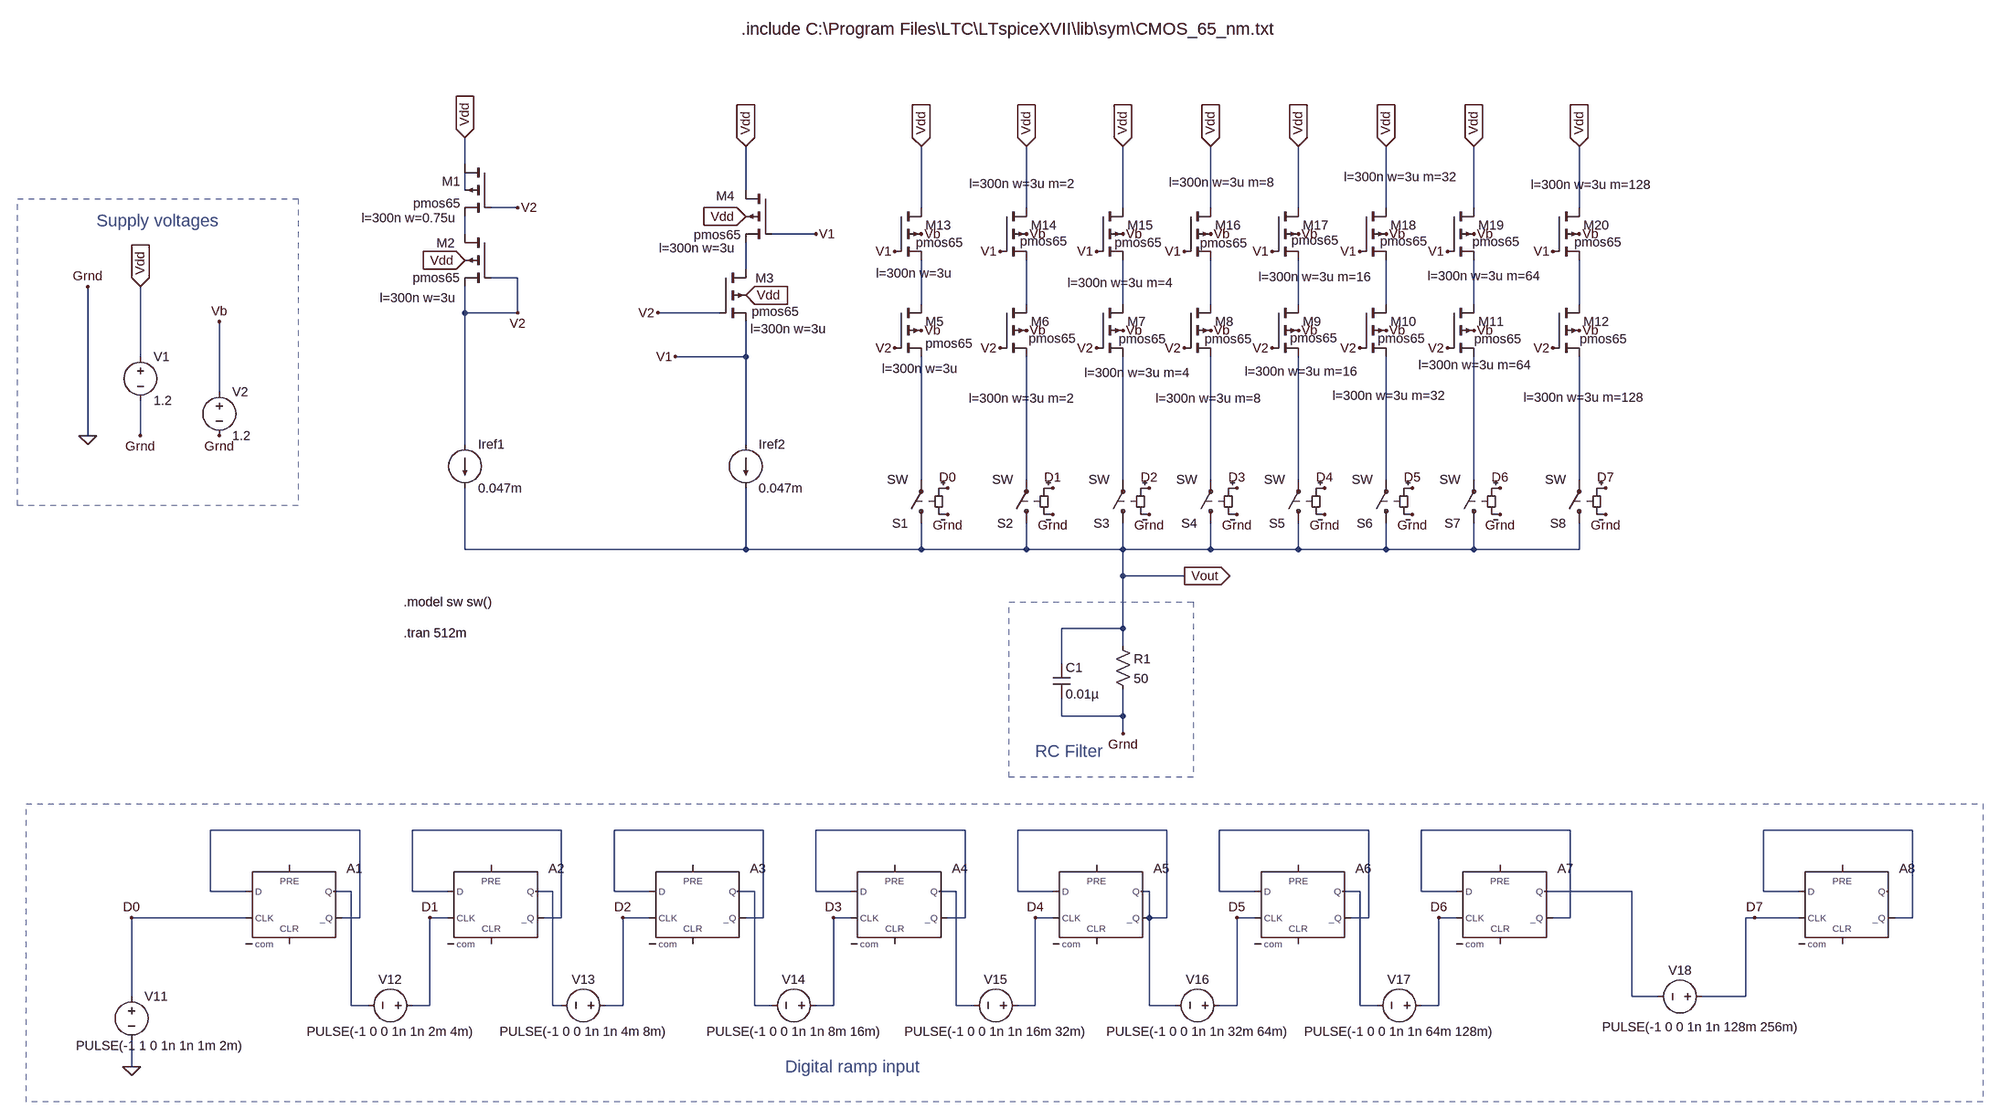
[diagram p0: schematic DAC_SOOCH_cm_capacitor_final.asc]
DAC_SOOCH_cm_capacitor_final.asc, the LTspice schematic file:
Version 4
SHEET 1 1972 2708
WIRE -800 -224 -800 -272
WIRE -800 -176 -800 -208
WIRE -288 -176 -288 -256
WIRE -704 -144 -752 -144
WIRE 32 -144 32 -256
WIRE 224 -144 224 -256
WIRE 400 -144 400 -256
WIRE 560 -144 560 -256
WIRE 720 -144 720 -256
WIRE 880 -144 880 -256
WIRE 1040 -144 1040 -256
WIRE 1232 -144 1232 -256
WIRE -800 -96 -800 -128
WIRE -160 -96 -240 -96
WIRE -288 -32 -288 -80
WIRE -704 -16 -752 -16
WIRE 32 32 32 -48
WIRE 224 32 224 -48
WIRE 400 32 400 -48
WIRE 560 32 560 -48
WIRE 720 32 720 -48
WIRE 880 32 880 -48
WIRE 1040 32 1040 -48
WIRE 1232 32 1232 -48
WIRE -800 48 -800 0
WIRE -704 48 -704 -16
WIRE -704 48 -800 48
WIRE -336 48 -448 48
WIRE -1392 128 -1392 0
WIRE -288 128 -288 64
WIRE -288 128 -416 128
WIRE -1248 192 -1248 64
WIRE -1488 272 -1488 0
WIRE -1392 272 -1392 208
WIRE -800 288 -800 48
WIRE -288 288 -288 128
WIRE 32 352 32 128
WIRE 224 352 224 128
WIRE 400 352 400 128
WIRE 560 352 560 128
WIRE 720 352 720 128
WIRE 880 352 880 128
WIRE 1040 352 1040 128
WIRE 1232 352 1232 128
WIRE -800 480 -800 368
WIRE -288 480 -288 368
WIRE -288 480 -800 480
WIRE 32 480 32 432
WIRE 32 480 -288 480
WIRE 224 480 224 432
WIRE 224 480 32 480
WIRE 400 480 400 432
WIRE 400 480 224 480
WIRE 560 480 560 432
WIRE 560 480 400 480
WIRE 720 480 720 432
WIRE 720 480 560 480
WIRE 880 480 880 432
WIRE 880 480 720 480
WIRE 1040 480 1040 432
WIRE 1040 480 880 480
WIRE 1232 480 1232 432
WIRE 1232 480 1040 480
WIRE 400 528 400 480
WIRE 512 528 400 528
WIRE 400 624 400 528
WIRE 400 624 288 624
WIRE 400 656 400 624
WIRE 288 688 288 624
WIRE 288 784 288 752
WIRE 400 784 400 736
WIRE 400 784 288 784
WIRE 400 816 400 784
WIRE -992 992 -1264 992
WIRE -624 992 -896 992
WIRE -256 992 -528 992
WIRE 112 992 -160 992
WIRE 480 992 208 992
WIRE 848 992 576 992
WIRE 1216 992 944 992
WIRE 1840 992 1568 992
WIRE -1264 1104 -1264 992
WIRE -1200 1104 -1264 1104
WIRE -1008 1104 -1040 1104
WIRE -896 1104 -896 992
WIRE -832 1104 -896 1104
WIRE -640 1104 -672 1104
WIRE -528 1104 -528 992
WIRE -464 1104 -528 1104
WIRE -272 1104 -304 1104
WIRE -160 1104 -160 992
WIRE -96 1104 -160 1104
WIRE 96 1104 64 1104
WIRE 208 1104 208 992
WIRE 272 1104 208 1104
WIRE 448 1104 432 1104
WIRE 576 1104 576 992
WIRE 640 1104 576 1104
WIRE 832 1104 800 1104
WIRE 944 1104 944 992
WIRE 1008 1104 944 1104
WIRE 1328 1104 1168 1104
WIRE 1568 1104 1568 992
WIRE 1632 1104 1568 1104
WIRE -1200 1152 -1408 1152
WIRE -992 1152 -992 992
WIRE -992 1152 -1024 1152
WIRE -832 1152 -864 1152
WIRE -624 1152 -624 992
WIRE -624 1152 -656 1152
WIRE -464 1152 -512 1152
WIRE -256 1152 -256 992
WIRE -256 1152 -288 1152
WIRE -96 1152 -128 1152
WIRE 112 1152 112 992
WIRE 112 1152 80 1152
WIRE 272 1152 240 1152
WIRE 448 1152 448 1104
WIRE 480 1152 480 992
WIRE 480 1152 448 1152
WIRE 640 1152 608 1152
WIRE 848 1152 848 992
WIRE 848 1152 816 1152
WIRE 1008 1152 976 1152
WIRE 1216 1152 1216 992
WIRE 1216 1152 1184 1152
WIRE 1552 1152 1536 1152
WIRE 1632 1152 1552 1152
WIRE 1840 1152 1840 992
WIRE 1840 1152 1808 1152
WIRE -1408 1296 -1408 1152
WIRE 1328 1296 1328 1104
WIRE 1376 1296 1328 1296
WIRE 1536 1296 1536 1152
WIRE 1536 1296 1456 1296
WIRE -1008 1312 -1008 1104
WIRE -976 1312 -1008 1312
WIRE -864 1312 -864 1152
WIRE -864 1312 -896 1312
WIRE -640 1312 -640 1104
WIRE -624 1312 -640 1312
WIRE -512 1312 -512 1152
WIRE -512 1312 -544 1312
WIRE -272 1312 -272 1104
WIRE -240 1312 -272 1312
WIRE -128 1312 -128 1152
WIRE -128 1312 -160 1312
WIRE 96 1312 96 1104
WIRE 128 1312 96 1312
WIRE 240 1312 240 1152
WIRE 240 1312 208 1312
WIRE 448 1312 448 1152
WIRE 496 1312 448 1312
WIRE 608 1312 608 1152
WIRE 608 1312 576 1312
WIRE 832 1312 832 1104
WIRE 864 1312 832 1312
WIRE 976 1312 976 1152
WIRE 976 1312 944 1312
WIRE -1408 1424 -1408 1376
FLAG -704 -144 V2
FLAG -800 -272 Vdd
IOPIN -800 -272 In
FLAG -1488 272 0
FLAG -1392 0 Vdd
IOPIN -1392 0 In
FLAG -1488 0 Grnd
FLAG -1392 272 Grnd
FLAG -800 -48 Vdd
IOPIN -800 -48 In
FLAG -288 -128 Vdd
IOPIN -288 -128 In
FLAG -288 16 Vdd
IOPIN -288 16 In
FLAG -704 48 V2
FLAG -160 -96 V1
FLAG -416 128 V1
FLAG -448 48 V2
FLAG -288 -256 Vdd
IOPIN -288 -256 In
FLAG 32 -256 Vdd
IOPIN 32 -256 In
FLAG 224 -256 Vdd
IOPIN 224 -256 In
FLAG 400 -256 Vdd
IOPIN 400 -256 In
FLAG 560 -256 Vdd
IOPIN 560 -256 In
FLAG 720 -256 Vdd
IOPIN 720 -256 In
FLAG 880 -256 Vdd
IOPIN 880 -256 In
FLAG 1040 -256 Vdd
IOPIN 1040 -256 In
FLAG -16 112 V2
FLAG 176 112 V2
FLAG 352 112 V2
FLAG 512 112 V2
FLAG 672 112 V2
FLAG 832 112 V2
FLAG 992 112 V2
FLAG 80 416 Grnd
FLAG 272 416 Grnd
FLAG 448 416 Grnd
FLAG 608 416 Grnd
FLAG 768 416 Grnd
FLAG 928 416 Grnd
FLAG 1088 416 Grnd
FLAG 1232 -256 Vdd
IOPIN 1232 -256 In
FLAG 1184 112 V2
FLAG 1280 416 Grnd
FLAG -16 -64 V1
FLAG 176 -64 V1
FLAG 352 -64 V1
FLAG 512 -64 V1
FLAG 672 -64 V1
FLAG 832 -64 V1
FLAG 992 -64 V1
FLAG 1184 -64 V1
FLAG 32 -96 Vb
FLAG 32 80 Vb
FLAG 224 80 Vb
FLAG 224 -96 Vb
FLAG 400 -96 Vb
FLAG 400 80 Vb
FLAG 560 -96 Vb
FLAG 560 80 Vb
FLAG 720 -96 Vb
FLAG 880 -96 Vb
FLAG 1040 -96 Vb
FLAG 1232 -96 Vb
FLAG 720 80 Vb
FLAG 880 80 Vb
FLAG 1040 80 Vb
FLAG 1232 80 Vb
FLAG 400 816 Grnd
FLAG 512 528 Vout
IOPIN 512 528 Out
FLAG -1248 272 Grnd
FLAG -1248 64 Vb
FLAG 80 368 D0
FLAG 272 368 D1
FLAG 448 368 D2
FLAG 608 368 D3
FLAG 768 368 D4
FLAG 928 368 D5
FLAG 1088 368 D6
FLAG 1280 368 D7
FLAG -1408 1152 D0
FLAG -1408 1424 0
FLAG 1552 1152 D7
FLAG -864 1152 D1
FLAG -512 1152 D2
FLAG -128 1152 D3
FLAG 240 1152 D4
FLAG 608 1152 D5
FLAG 976 1152 D6
SYMBOL pmos4 -752 -224 M0
WINDOW 123 64 99 Left 2
SYMATTR Value2 l=300n w=0.75u
SYMATTR InstName M1
SYMATTR Value pmos65
SYMBOL pmos4 -752 -96 M0
WINDOW 123 64 117 Left 2
WINDOW 0 66 17 Left 2
WINDOW 3 57 80 Left 2
SYMATTR Value2 l=300n w=3u
SYMATTR InstName M2
SYMATTR Value pmos65
SYMBOL current -800 288 R0
WINDOW 123 0 0 Left 0
WINDOW 39 0 0 Left 0
SYMATTR InstName Iref1
SYMATTR Value 0.047m
SYMBOL voltage -1392 112 R0
SYMATTR InstName V1
SYMATTR Value 1.2
SYMBOL pmos4 -336 -32 R0
WINDOW 123 57 109 Left 2
WINDOW 0 66 17 Left 2
WINDOW 3 59 78 Left 2
SYMATTR Value2 l=300n w=3u
SYMATTR InstName M3
SYMATTR Value pmos65
SYMBOL pmos4 -240 -176 M0
WINDOW 123 67 106 Left 2
WINDOW 0 68 11 Left 2
WINDOW 3 56 82 Left 2
SYMATTR Value2 l=300n w=3u
SYMATTR InstName M4
SYMATTR Value pmos65
SYMBOL current -288 288 R0
WINDOW 123 0 0 Left 0
WINDOW 39 0 0 Left 0
SYMATTR InstName Iref2
SYMATTR Value 0.047m
SYMBOL pmos4 -16 32 R0
WINDOW 123 -23 118 Left 2
SYMATTR Value2 l=300n w=3u
SYMATTR InstName M5
SYMATTR Value pmos65
SYMBOL pmos4 176 32 R0
WINDOW 3 52 63 Left 2
WINDOW 123 -57 172 Left 2
SYMATTR Value pmos65
SYMATTR Value2 l=300n w=3u m=2
SYMATTR InstName M6
SYMBOL pmos4 352 32 R0
WINDOW 3 40 64 Left 2
WINDOW 123 -22 125 Left 2
SYMATTR Value pmos65
SYMATTR Value2 l=300n w=3u m=4
SYMATTR InstName M7
SYMBOL pmos4 512 32 R0
WINDOW 3 37 64 Left 2
WINDOW 123 -52 172 Left 2
SYMATTR Value pmos65
SYMATTR Value2 l=300n w=3u m=8
SYMATTR InstName M8
SYMBOL pmos4 672 32 R0
WINDOW 3 33 62 Left 2
WINDOW 123 -50 123 Left 2
SYMATTR Value pmos65
SYMATTR Value2 l=300n w=3u m=16
SYMATTR InstName M9
SYMBOL pmos4 832 32 R0
WINDOW 3 33 63 Left 2
WINDOW 123 -50 167 Left 2
SYMATTR Value pmos65
SYMATTR Value2 l=300n w=3u m=32
SYMATTR InstName M10
SYMBOL pmos4 992 32 R0
WINDOW 3 49 64 Left 2
WINDOW 123 -53 111 Left 2
SYMATTR Value pmos65
SYMATTR Value2 l=300n w=3u m=64
SYMATTR InstName M11
SYMBOL sw 32 448 R180
SYMATTR InstName S1
SYMBOL sw 224 448 R180
SYMATTR InstName S2
SYMBOL sw 400 448 R180
SYMATTR InstName S3
SYMBOL sw 560 448 R180
SYMATTR InstName S4
SYMBOL sw 720 448 R180
SYMATTR InstName S5
SYMBOL sw 880 448 R180
SYMATTR InstName S6
SYMBOL sw 1040 448 R180
SYMATTR InstName S7
SYMBOL pmos4 1184 32 R0
WINDOW 3 49 64 Left 2
WINDOW 123 -53 170 Left 2
SYMATTR Value pmos65
SYMATTR Value2 l=300n w=3u m=128
SYMATTR InstName M12
SYMBOL sw 1232 448 R180
SYMATTR InstName S8
SYMBOL pmos4 -16 -144 R0
WINDOW 3 38 64 Left 2
WINDOW 123 -34 120 Left 2
SYMATTR Value pmos65
SYMATTR Value2 l=300n w=3u
SYMATTR InstName M13
SYMBOL pmos4 176 -144 R0
WINDOW 3 36 61 Left 2
WINDOW 123 -56 -44 Left 2
SYMATTR Value pmos65
SYMATTR Value2 l=300n w=3u m=2
SYMATTR InstName M14
SYMBOL pmos4 352 -144 R0
WINDOW 3 33 64 Left 2
WINDOW 123 -53 137 Left 2
SYMATTR Value pmos65
SYMATTR Value2 l=300n w=3u m=4
SYMATTR InstName M15
SYMBOL pmos4 512 -144 R0
WINDOW 3 29 65 Left 2
WINDOW 123 -28 -46 Left 2
SYMATTR Value pmos65
SYMATTR Value2 l=300n w=3u m=8
SYMATTR InstName M16
SYMBOL pmos4 672 -144 R0
WINDOW 3 35 60 Left 2
WINDOW 123 -25 126 Left 2
SYMATTR Value pmos65
SYMATTR Value2 l=300n w=3u m=16
SYMATTR InstName M17
SYMBOL pmos4 832 -144 R0
WINDOW 3 37 61 Left 2
WINDOW 123 -29 -56 Left 2
SYMATTR Value pmos65
SYMATTR Value2 l=300n w=3u m=32
SYMATTR InstName M18
SYMBOL pmos4 992 -144 R0
WINDOW 3 45 62 Left 2
WINDOW 123 -36 125 Left 2
SYMATTR Value pmos65
SYMATTR Value2 l=300n w=3u m=64
SYMATTR InstName M19
SYMBOL pmos4 1184 -144 R0
WINDOW 3 39 63 Left 2
WINDOW 123 -40 -42 Left 2
SYMATTR Value pmos65
SYMATTR Value2 l=300n w=3u m=128
SYMATTR InstName M20
SYMBOL res 384 640 R0
SYMATTR InstName R1
SYMATTR Value 50
SYMBOL voltage -1248 176 R0
WINDOW 123 0 0 Left 0
WINDOW 39 0 0 Left 0
SYMATTR InstName V2
SYMATTR Value 1.2
SYMBOL cap 272 688 R0
SYMATTR InstName C1
SYMATTR Value 0.01µ
SYMBOL Digital\\dflop -1120 1056 R0
SYMATTR InstName A1
SYMBOL Digital\\dflop -752 1056 R0
SYMATTR InstName A2
SYMBOL Digital\\dflop -384 1056 R0
SYMATTR InstName A3
SYMBOL Digital\\dflop -16 1056 R0
SYMATTR InstName A4
SYMBOL Digital\\dflop 352 1056 R0
SYMATTR InstName A5
SYMBOL Digital\\dflop 720 1056 R0
SYMATTR InstName A6
SYMBOL Digital\\dflop 1088 1056 R0
SYMATTR InstName A7
SYMBOL Digital\\dflop 1712 1056 R0
SYMATTR InstName A8
SYMBOL voltage -1408 1280 R0
WINDOW 123 0 0 Left 0
WINDOW 39 0 0 Left 0
WINDOW 3 -101 106 Left 2
SYMATTR Value PULSE(-1 1 0 1n 1n 1m 2m)
SYMATTR InstName V11
SYMBOL voltage -880 1312 R90
WINDOW 0 -32 56 VBottom 2
WINDOW 3 32 56 VTop 2
WINDOW 123 0 0 Left 0
WINDOW 39 0 0 Left 0
SYMATTR InstName V12
SYMATTR Value PULSE(-1 0 0 1n 1n 2m 4m)
SYMBOL voltage -528 1312 R90
WINDOW 0 -32 56 VBottom 2
WINDOW 3 32 56 VTop 2
WINDOW 123 0 0 Left 0
WINDOW 39 0 0 Left 0
SYMATTR InstName V13
SYMATTR Value PULSE(-1 0 0 1n 1n 4m 8m)
SYMBOL voltage -144 1312 R90
WINDOW 0 -32 56 VBottom 2
WINDOW 3 32 56 VTop 2
WINDOW 123 0 0 Left 0
WINDOW 39 0 0 Left 0
SYMATTR InstName V14
SYMATTR Value PULSE(-1 0 0 1n 1n 8m 16m)
SYMBOL voltage 224 1312 R90
WINDOW 0 -32 56 VBottom 2
WINDOW 3 32 56 VTop 2
WINDOW 123 0 0 Left 0
WINDOW 39 0 0 Left 0
SYMATTR InstName V15
SYMATTR Value PULSE(-1 0 0 1n 1n 16m 32m)
SYMBOL voltage 592 1312 R90
WINDOW 0 -32 56 VBottom 2
WINDOW 3 32 56 VTop 2
WINDOW 123 0 0 Left 0
WINDOW 39 0 0 Left 0
SYMATTR InstName V16
SYMATTR Value PULSE(-1 0 0 1n 1n 32m 64m)
SYMBOL voltage 960 1312 R90
WINDOW 0 -32 56 VBottom 2
WINDOW 3 32 56 VTop 2
WINDOW 123 0 0 Left 0
WINDOW 39 0 0 Left 0
SYMATTR InstName V17
SYMATTR Value PULSE(-1 0 0 1n 1n 64m 128m)
SYMBOL voltage 1472 1296 R90
WINDOW 0 -32 56 VBottom 2
WINDOW 3 40 18 VTop 2
WINDOW 123 0 0 Left 0
WINDOW 39 0 0 Left 0
SYMATTR InstName V18
SYMATTR Value PULSE(-1 0 0 1n 1n 128m 256m)
TEXT -296 -472 Left 3 !.include C:\\Program Files\\LTC\\LTspiceXVII\\lib\\sym\\CMOS_65_nm.txt
TEXT -912 576 Left 2 !.model sw sw()
TEXT -912 632 Left 2 !.tran 512m
TEXT -1472 -120 Left 3 ;Supply voltages
TEXT 240 848 Left 3 ;RC Filter
TEXT -216 1424 Left 3 ;Digital ramp input
RECTANGLE Normal -1104 400 -1616 -160 2
RECTANGLE Normal 528 896 192 576 2
RECTANGLE Normal 1968 1488 -1600 944 2

The netlist it stands for:
* DAC_SOOCH_cm_capacitor_final.asc
M1 Vdd V2 N002 N001 pmos65 l=300n w=0.75u
M2 N002 V2 V2 Vdd pmos65 l=300n w=3u
Iref1 V2 Vout 0.047m
V1 Vdd 0 1.2
M3 N003 V2 V1 Vdd pmos65 l=300n w=3u
M4 Vdd V1 N003 Vdd pmos65 l=300n w=3u
Iref2 V1 Vout 0.047m
M5 N004 V2 N012 Vb pmos65 l=300n w=3u
M6 N005 V2 N013 Vb pmos65 l=300n w=3u m=2
M7 N006 V2 N014 Vb pmos65 l=300n w=3u m=4
M8 N007 V2 N015 Vb pmos65 l=300n w=3u m=8
M9 N008 V2 N016 Vb pmos65 l=300n w=3u m=16
M10 N009 V2 N017 Vb pmos65 l=300n w=3u m=32
M11 N010 V2 N018 Vb pmos65 l=300n w=3u m=64
S1 Vout N012 D0 0 SW
S2 Vout N013 D1 0 SW
S3 Vout N014 D2 0 SW
S4 Vout N015 D3 0 SW
S5 Vout N016 D4 0 SW
S6 Vout N017 D5 0 SW
S7 Vout N018 D6 0 SW
M12 N011 V2 N019 Vb pmos65 l=300n w=3u m=128
S8 Vout N019 D7 0 SW
M13 Vdd V1 N004 Vb pmos65 l=300n w=3u
M14 Vdd V1 N005 Vb pmos65 l=300n w=3u m=2
M15 Vdd V1 N006 Vb pmos65 l=300n w=3u m=4
M16 Vdd V1 N007 Vb pmos65 l=300n w=3u m=8
M17 Vdd V1 N008 Vb pmos65 l=300n w=3u m=16
M18 Vdd V1 N009 Vb pmos65 l=300n w=3u m=32
M19 Vdd V1 N010 Vb pmos65 l=300n w=3u m=64
M20 Vdd V1 N011 Vb pmos65 l=300n w=3u m=128
R1 Vout 0 50
V2 Vb 0 1.2
C1 Vout 0 0.01µ
A1 N020 0 D0 0 0 N020 N028 0 DFLOP
A2 N021 0 D1 0 0 N021 N029 0 DFLOP
A3 N022 0 D2 0 0 N022 N030 0 DFLOP
A4 N023 0 D3 0 0 N023 N031 0 DFLOP
A5 N024 0 D4 0 0 N024 N024 0 DFLOP
A6 N025 0 D5 0 0 N025 N032 0 DFLOP
A7 N026 0 D6 0 0 N026 N033 0 DFLOP
A8 N027 0 D7 0 0 N027 0 0 DFLOP
V11 D0 0 PULSE(-1 1 0 1n 1n 1m 2m)
V12 D1 N028 PULSE(-1 0 0 1n 1n 2m 4m)
V13 D2 N029 PULSE(-1 0 0 1n 1n 4m 8m)
V14 D3 N030 PULSE(-1 0 0 1n 1n 8m 16m)
V15 D4 N031 PULSE(-1 0 0 1n 1n 16m 32m)
V16 D5 N024 PULSE(-1 0 0 1n 1n 32m 64m)
V17 D6 N032 PULSE(-1 0 0 1n 1n 64m 128m)
V18 D7 N033 PULSE(-1 0 0 1n 1n 128m 256m)
.model NMOS NMOS
.model PMOS PMOS
.lib standard.mos
.include C:\Program Files\LTC\LTspiceXVII\lib\sym\CMOS_65_nm.txt
.model sw sw()
.tran 512m
* Supply voltages
* RC Filter
* Digital ramp input
.backanno
.end